# EAGLE design E32_Roco_43917_Deckel_J1_019_03_01 (EAGLE 5.10)
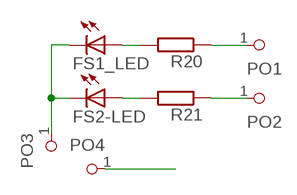
[diagram p0: schematic, sheet 1]

## Parts
FS1_LED  LEDCHIP-LED0603  [CHIP-LED0603]
FS2-LED  LEDCHIP-LED0603  [CHIP-LED0603]
PO1  POGO2,6MM  [POGO2.6]
PO2  POGO2,6MM  [POGO2.6]
PO3  POGO2,6MM  [POGO2.6]
PO4  POGO2,6MM  [POGO2.6]
R20  R-EU_R0603S  [R0603S]
R21  R-EU_R0603S  [R0603S]

## Nets
GND_D: FS1_LED.C FS2-LED.C PO3.1
IO/B_D: PO2.1 R21.1
IO/C_D: PO1.1 R20.1
N$2: FS1_LED.A R20.2
N$6: FS2-LED.A R21.2
SCHLEIFER_D: PO4.1

## Library data of the parts
FS1_LED FS2-LED = led:LED: LED OSRAM: - CHIPLED LG R971, LG N971, LY N971, LG Q971, LY Q971, LO R971, LY R971 LH N974, LH R974 LS Q976, LO Q976, LY Q976 LO Q996 - Hyper CHIPLED LW Q18S LB Q993, LB Q99A, LB R99A - SideLED LS A670, LO A670, LY A670, LG A670, LP A670 LB A673, LV A673, LT A673, LW A673 LH A674 LY A675 LS A676, LA A676, LO A676, LY A676, LW A676 LS A679, LY A679, LG A679 - Hyper Micro SIDELED® LS Y876, LA Y876, LO Y876, LY Y876 LT Y87S - SmartLED LW L88C, LW L88S LB L89C, LB L89S, LG L890 LS L89K, LO L89K, LY L89K LS L896, LA L896, LO L896, LY L896 - TOPLED LS T670, LO T670, LY T670, LG T670, LP T670 LSG T670, LSP T670, LSY T670, LOP T670, LYG T670 LG T671, LOG T671, LSG T671 LB T673, LV T673, LT T673, LW T673 LH T674 LS T676, LA T676, LO T676, LY T676, LB T676, LH T676, LSB T676, LW T676 LB T67C, LV T67C, LT T67C, LS T67K, LO T67K, LY T67K, LW E67C LS E67B, LA E67B, LO E67B, LY E67B, LB E67C, LV E67C, LT E67C LW T67C LS T679, LY T679, LG T679 LS T770, LO T770, LY T770, LG T770, LP T770 LB T773, LV T773, LT T773, LW T773 LH T774 LS E675, LA E675, LY E675, LS T675 LS T776, LA T776, LO T776, LY T776, LB T776 LHGB T686 LT T68C, LB T68C - Hyper Mini TOPLED® LB M676 - Mini TOPLED Santana® LG M470 LS M47K, LO M47K, LY M47K Source: http://www.osram.convergy.de LUXEON: - LUMILED® LXK2-PW12-R00, LXK2-PW12-S00, LXK2-PW14-U00, LXK2-PW14-V00 LXK2-PM12-R00, LXK2-PM12-S00, LXK2-PM14-U00 LXK2-PE12-Q00, LXK2-PE12-R00, LXK2-PE12-S00, LXK2-PE14-T00, LXK2-PE14-U00 LXK2-PB12-K00, LXK2-PB12-L00, LXK2-PB12-M00, LXK2-PB14-N00, LXK2-PB14-P00, LXK2-PB14-Q00 LXK2-PR12-L00, LXK2-PR12-M00, LXK2-PR14-Q00, LXK2-PR14-R00 LXK2-PD12-Q00, LXK2-PD12-R00, LXK2-PD12-S00 LXK2-PH12-R00, LXK2-PH12-S00 LXK2-PL12-P00, LXK2-PL12-Q00, LXK2-PL12-R00 Source: www.luxeon.com KINGBRIGHT: KA-3528ASYC Source: www.kingbright.com
PO1-PO4 = pinhead:POGO
R20 R21 = rcl:R-EU_: RESISTOR, European symbol

## Board
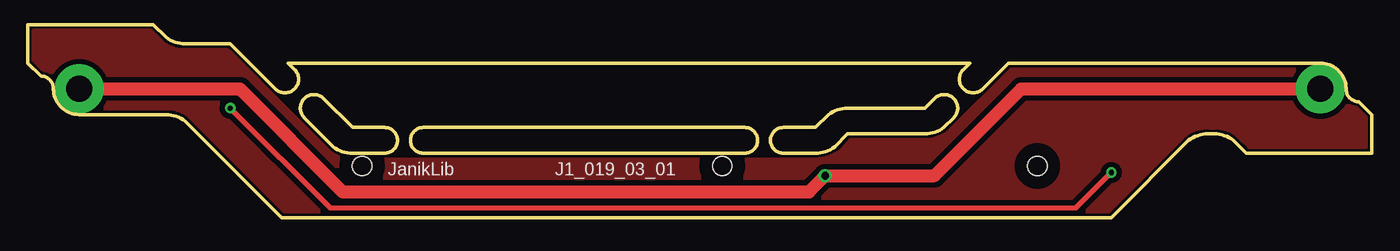
[diagram p1: board, top side]
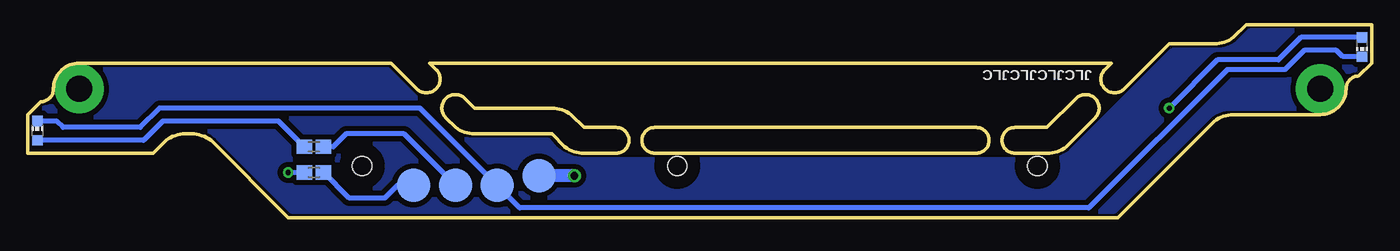
[diagram p2: board, bottom side, seen from below]

No outline drawn. Coordinates in mm, seen from the top.
Copper layers (1*16): Top 0.035mm / dielectric 1.5mm / Bottom 0.035mm
Design rules "default *": minimum track width 10mil, minimum drill 0.4mm, track to track 8mil, track to pad 8mil, pad to pad 8mil, via to via 8mil, smd to smd 8mil, copper to edge 40mil, drill to drill 8mil, minimum pad ring 10mil, minimum via ring 8mil, stop-mask expansion 4mil, vias tented up to drill 0mil, thermal gap 10mil
Holes 1.5 mm at 18.75,9 46.75,9 71.25,9
Milling: 62 lines

### Footprints (pad centres in the part's own frame; a part is rotated, then mirrored left to right if it is on the bottom)
CHIP-LED0603 = smd 0.8 x 0.8: A 0,-0.75; C 0,0.75
POGO2.6 = smd 2.6 x 2.6: 1 0,0
R0603S = smd 1.2 x 1.1: 1 -0.75,0; 2 0.75,0

### Placement (x,y rotation side)
FS1_LED  -6.5,18.25 180 bottom
FS2-LED  96.5,11.75 0 bottom
PO1  67.25,7.5 0 bottom
PO2  64,7.5 0 bottom
PO3  60.75,7.5 0 bottom
PO4  57.5,8.25 0 bottom
R20  75,8.5 180 bottom
R21  75,10.5 180 bottom

### Tracks (layer width: path | path; a pad name or v marks a point on that pad's centre or on a via)
GND_D
  Bottom 0.406: FS1_LED.C -5,17.5 -4.5,18 -2,18 -0.5,16.5 4,16.5 14.75,5.75 59,5.75 PO3.1 66.75,13.5 87,13.5 88.5,12 94.5,12 95,12.5 FS2-LED.C
IO/B_D
  Bottom 0.406: R21.1 73.5,10.5 72.5,11.5 68,11.5 PO2.1
IO/C_D
  Bottom 0.406: PO1.1 68.5,7.5 69.5,6.5 72.25,6.5 R20.1
N$1
  pour Top (isolate 0.406, rank 2): -6.75,19.5 2.25,19.5 3,18.75 arc49 5,18 8.25,18 16,10.25 arc49 18,9.5 54,9.5 arc57 56.75,11 62.5,11 arc41 64.5,11.75 69.25,16.5 93.25,16.5 arc-90 94.75,15 arc90 96,13.5 96.75,12.75 96.75,10.5 87.75,10.5 87,11.25 arc49 85,12 arc-8 84.5,12 arc49 82.5,11.25 76.75,5.5 12.75,5.5 5.5,12.75 arc49 3.5,13.5 -3.25,13.5 arc-90 -4.75,15 arc90 -6,16.5 -6.75,17.25
  pour Bottom (isolate 0.406, rank 2): -6.75,19.5 2.25,19.5 3,18.75 arc49 5,18 8.25,18 16,10.25 arc49 18,9.5 54,9.5 arc57 56.75,11 62.5,11 arc41 64.5,11.75 69.25,16.5 93.25,16.5 arc-90 94.75,15 arc90 96,13.5 96.75,12.75 96.75,10.5 87.75,10.5 87,11.25 arc49 85,12 arc-8 84.5,12 arc49 82.5,11.25 76.75,5.5 12.75,5.5 5.5,12.75 arc49 3.5,13.5 -3.25,13.5 arc-90 -4.75,15 arc90 -6,16.5 -6.75,17.25
N$2  (via drill 0.4)
  Top 0.406: v77,8.5 74.25,5.75 16.25,5.75 v8.5,13.5
  Bottom 0.406: FS1_LED.A -1.75,19 0,17.25 4.75,17.25 v8.5,13.5 | v77,8.5 R20.2
N$6
  Bottom 0.406: FS2-LED.A 88.25,11 86.75,12.5 77.75,12.5 R21.2
SCHLEIFER_D  (via drill 0.6, 2 pad 3.8)
  Top 1.016: v93.25,15 70,15 63.25,8.25 v54.75,8.25 53.5,7 17.25,7 9.25,15 v-3.25,15
  Bottom 1.016: v54.75,8.25 PO4.1

### Text on the board
tNames: JanikLib | J1_019_03_01
bNames: JLCJLCJLCJLC
bStop: Roco E32 43917 | design by Janik Merz
Document: Dicke max 0,6mm